# Altium schematic sheet LevelShifters.SchDoc
size A
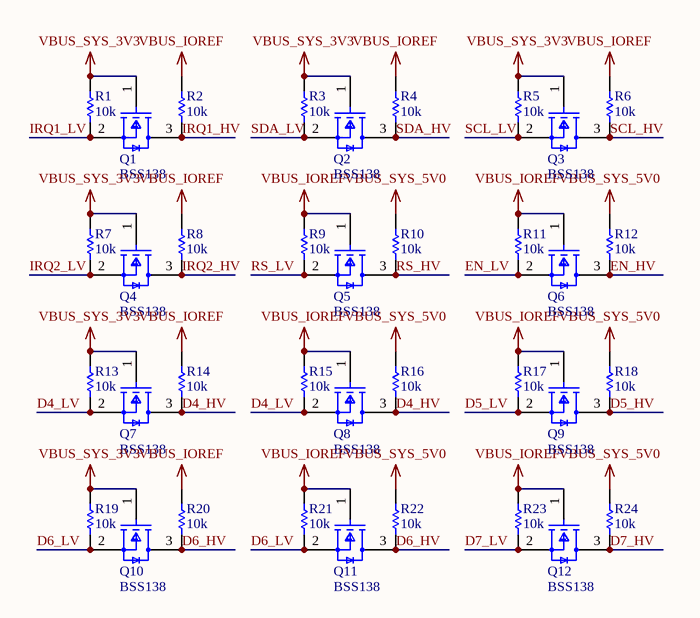
[diagram p0: LevelShifters.SchDoc]

## Parts
Q1  BSS138  [FP-318-08-IPC_B]
Q2  BSS138  [FP-318-08-IPC_B]
Q3  BSS138  [FP-318-08-IPC_B]
Q4  BSS138  [FP-318-08-IPC_B]
Q5  BSS138  [FP-318-08-IPC_B]
Q6  BSS138  [FP-318-08-IPC_B]
Q7  BSS138  [FP-318-08-IPC_B]
Q8  BSS138  [FP-318-08-IPC_B]
Q9  BSS138  [FP-318-08-IPC_B]
Q10  BSS138  [FP-318-08-IPC_B]
Q11  BSS138  [FP-318-08-IPC_B]
Q12  BSS138  [FP-318-08-IPC_B]
R1  10k  [0805_RES_HD]
R2  10k  [0805_RES_HD]
R3  10k  [0805_RES_HD]
R4  10k  [0805_RES_HD]
R5  10k  [0805_RES_HD]
R6  10k  [0805_RES_HD]
R7  10k  [0805_RES_HD]
R8  10k  [0805_RES_HD]
R9  10k  [0805_RES_HD]
R10  10k  [0805_RES_HD]
R11  10k  [0805_RES_HD]
R12  10k  [0805_RES_HD]
R13  10k  [0805_RES_HD]
R14  10k  [0805_RES_HD]
R15  10k  [0805_RES_HD]
R16  10k  [0805_RES_HD]
R17  10k  [0805_RES_HD]
R18  10k  [0805_RES_HD]
R19  10k  [0805_RES_HD]
R20  10k  [0805_RES_HD]
R21  10k  [0805_RES_HD]
R22  10k  [0805_RES_HD]
R23  10k  [0805_RES_HD]
R24  10k  [0805_RES_HD]

## Nets
VBUS_IOREF: Q5.1(G) Q6.1(G) Q8.1(G) Q9.1(G) Q11.1(G) Q12.1(G) R2.1 R4.1 R6.1 R8.1 R9.1 R11.1 R14.1 R15.1 R17.1 R20.1 R21.1 R23.1
VBUS_SYS_3V3: Q1.1(G) Q2.1(G) Q3.1(G) Q4.1(G) Q7.1(G) Q10.1(G) R1.1 R3.1 R5.1 R7.1 R13.1 R19.1
VBUS_SYS_5V0: R10.1 R12.1 R16.1 R18.1 R22.1 R24.1
D4_HV: Q7.3(D) Q8.3(D) R14.2 R16.2
D4_LV: Q7.2(S) Q8.2(S) R13.2 R15.2
D5_HV: Q9.3(D) R18.2
D5_LV: Q9.2(S) R17.2
D6_HV: Q10.3(D) Q11.3(D) R20.2 R22.2
D6_LV: Q10.2(S) Q11.2(S) R19.2 R21.2
D7_HV: Q12.3(D) R24.2
D7_LV: Q12.2(S) R23.2
EN_HV: Q6.3(D) R12.2
EN_LV: Q6.2(S) R11.2
IRQ1_HV: Q1.3(D) R2.2
IRQ1_LV: Q1.2(S) R1.2
IRQ2_HV: Q4.3(D) R8.2
IRQ2_LV: Q4.2(S) R7.2
RS_HV: Q5.3(D) R10.2
RS_LV: Q5.2(S) R9.2
SCL_HV: Q3.3(D) R6.2
SCL_LV: Q3.2(S) R5.2
SDA_HV: Q2.3(D) R4.2
SDA_LV: Q2.2(S) R3.2

## Library data of the parts
Q1-Q12 = CMP-07173-000101-1: MOSFET N-CH 50V 220MA SOT-23; Turn-Off Delay Time: 20ns; Element Configuration: Single; Rds On Max: 3.5R; Gate to Source Voltage (Vgs): 20V; Threshold Voltage: 1.3V; Number of Elements: 1; Power Dissipation: 360mW; Rise Time: 9ns; Turn-On Delay Time: 2.5ns; Input Capacitance: 27pF; On-State Resistance: 6R; Lead Free: Lead Free; Length: 2.92mm; Width: 1.3mm; Drain to Source Breakdown Voltage: 50V; Min Operating Temperature: -55°C; REACH SVHC: No SVHC; Packaging: Tape and Reel; Radiation Hardening: No; Height: 0.93mm; Drain to Source Voltage (Vdss): 50V; Current Rating: 220mA; Voltage Rating (DC): 50V; Weight: 0.03g; Continuous Drain Current (ID): 220mA; Number of Pins: 3; Nominal Vgs: 1.3V; Max Power Dissipation: 360mW; Fall Time: 9ns; Drain to Source Resistance: 3.5R; Contact Plating: Tin; Case/Package: SOT-23; Package Quantity: 1; Dual Supply Voltage: 50V; Mount: Surface Mount; Termination: SMD/SMT; Max Operating Temperature: 150°C
R1-R24 = RC0805FR-07100RL: 50k Ohm ±1% 0.125W, 1/8W Surface Mount Resistor Thick Film ±100ppm/°C 0805; Manufacturer 1: Yageo; GFUPartNo: RC0805FR-07100RL; Manufacturer Part Number 1: RC0805FR-07100RL; Part Type: SMT; Supplier 1: Digi-Key; Supplier Part Number 1: 311-100CRCT-ND